# Altium schematic sheet Power_supply.SchDoc
size A; SheetNumber: 1; SheetTotal: 3
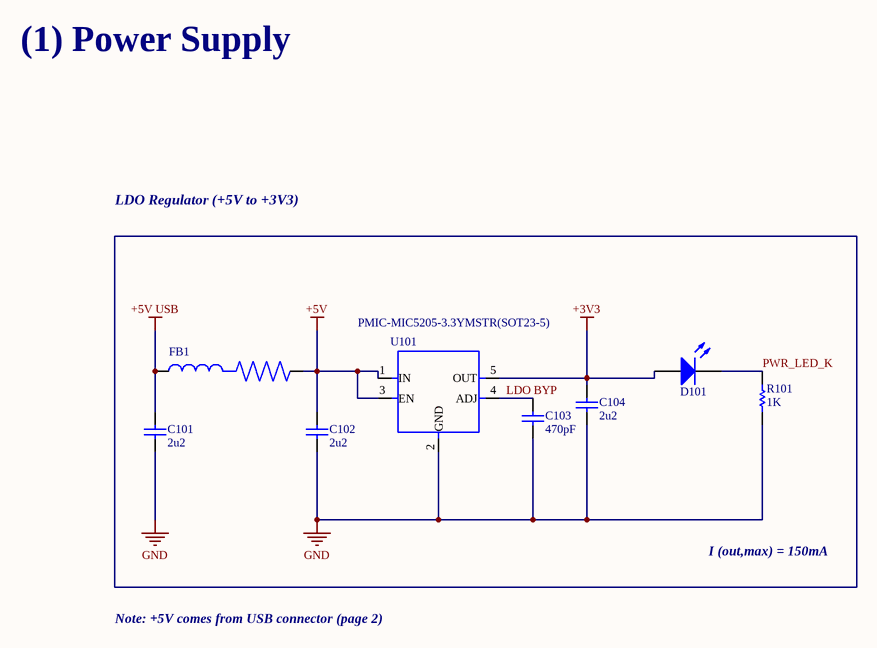
[diagram p0: Power_supply.SchDoc]

## Parts
C101  value 2u2  [CAP-SM-0805]  (hidden comment: Cap Non-Pol SMD)
C102  value 2u2  [CAP-SM-0805]  (hidden comment: Cap Non-Pol SMD)
C103  value 470pF  [CAP-SM-0805]  (hidden comment: Cap Non-Pol SMD)
C104  value 2u2  [CAP-SM-0805]  (hidden comment: Cap Non-Pol SMD)
D101  LED SMD  [LED_0603_Blue]  (value not drawn)
FB1  (no value)  [BEADC0603X33N]
R101  value 1K  [RES-SM-0603]  (hidden comment: RESISTOR SMD)
U101  PMIC-MIC5205-3.3YMSTR(SOT23-5)  [SOT-23-5]

## Nets
+3V3: C104.2 D101.1(A) U101.5(OUT)
+5V: C102.2 FB1.2 U101.1(IN) U101.3(EN)
+5V USB: C101.2 FB1.1
GND: C101.1 C102.1 C103.1 C104.1 R101.1 U101.2(GND)
LDO BYP: C103.2 U101.4(ADJ)
PWR_LED_K: D101.2(K) R101.2

## Notes on the sheet
- (1) Power Supply
- LDO Regulator (+5V to +3V3)
- I (out,max) = 150mA
- Note: +5V comes from USB connector (page 2)

## Library data of the parts
C101-C104 = Cap Non-Pol SMD: Capacitor
D101 = LED SMD: LED
FB1 = BLM03HD331SZ1D: Ferrite Bead; MF: Murata; SnapEDA_Link: https://www.snapeda.com/parts/BLM03HD331SZ1D/Murata/view-part/?ref=snap; Package: 0603 Murata; Value: *; MP: BLM03HD331SZ1D; Check_prices: https://www.snapeda.com/parts/BLM03HD331SZ1D/Murata/view-part/?ref=eda
R101 = RESISTOR SMD: Resistor
U101 = PMIC-MIC5205-3.3YMSTR(SOT23-5): Linear Voltage Regulator IC Positive Fixed 1 Output 150mA SOT-23-5; MF: Microchip; MP: MIC5205-3.3YM5-TR; SnapEDA_Link: https://www.snapeda.com/parts/MIC5205-3.3YM5-TR/Microchip/view-part/?ref=snap; Package: SOT-23-5 Microchip; Value: *; Check_prices: https://www.snapeda.com/parts/MIC5205-3.3YM5-TR/Microchip/view-part/?ref=eda